# Altium schematic sheet Output.SchDoc
size A4; SheetNumber: 4; SheetTotal: 4
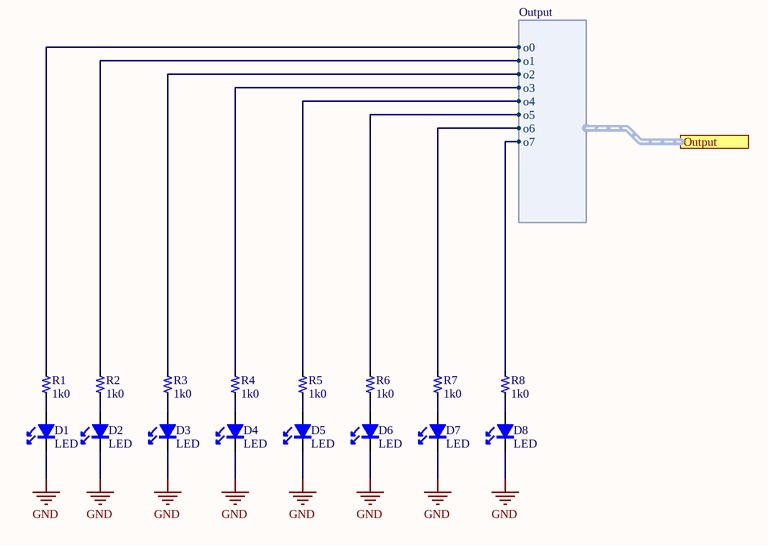
[diagram p0: Output.SchDoc]

## Parts
D1  LED  [LED-0805]
D2  LED  [LED-0805]
D3  LED  [LED-0805]
D4  LED  [LED-0805]
D5  LED  [LED-0805]
D6  LED  [LED-0805]
D7  LED  [LED-0805]
D8  LED  [LED-0805]
R1  1k0  [R0805]
R2  1k0  [R0805]
R3  1k0  [R0805]
R4  1k0  [R0805]
R5  1k0  [R0805]
R6  1k0  [R0805]
R7  1k0  [R0805]
R8  1k0  [R0805]

## Ports
Output (harness Output)

## Harnesses
Output: o0, o1, o2, o3, o4, o5, o6, o7

## Nets
GND: D1.1 D2.1 D3.1 D4.1 D5.1 D6.1 D7.1 D8.1
NetD1_2: D1.2 R1.1
NetD2_2: D2.2 R2.1
NetD3_2: D3.2 R3.1
NetD4_2: D4.2 R4.1
NetD5_2: D5.2 R5.1
NetD6_2: D6.2 R6.1
NetD7_2: D7.2 R7.1
NetD8_2: D8.2 R8.1
NetR1_2: R1.2 ; port Output.o0
NetR2_2: R2.2 ; port Output.o1
NetR3_2: R3.2 ; port Output.o2
NetR4_2: R4.2 ; port Output.o3
NetR5_2: R5.2 ; port Output.o4
NetR6_2: R6.2 ; port Output.o5
NetR7_2: R7.2 ; port Output.o6
NetR8_2: R8.2 ; port Output.o7

## Library data of the parts
D1-D8 = LED: LED - Light-Emitting Diode; Manufacturer: *; Part number: *; Unit price: *; Value: LED
R1-R8 = Resistor: Single resistor; Power: 0.125W; Manufacturer: *; Part number: *; Value: 1k0; Unit price: 0.1